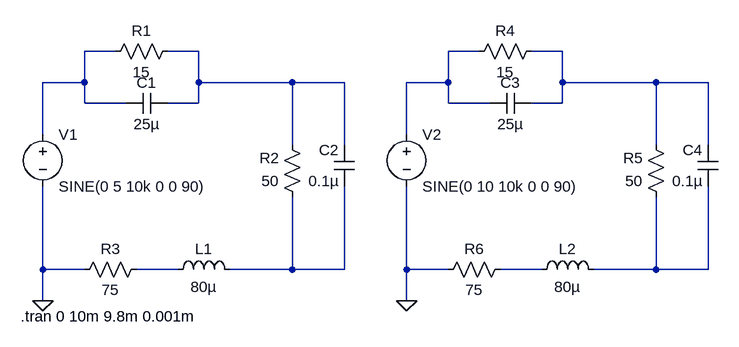
[diagram p0: schematic RTR806_Class_14_20231102_Investigation_of_linearity.asc]
RTR806_Class_14_20231102_Investigation_of_linearity.asc, the LTspice schematic file:
Version 4
SHEET 1 2148 680
WIRE 112 -32 64 -32
WIRE 240 -32 192 -32
WIRE 672 -32 624 -32
WIRE 800 -32 752 -32
WIRE 64 16 64 -32
WIRE 64 16 0 16
WIRE 240 16 240 -32
WIRE 384 16 240 16
WIRE 464 16 384 16
WIRE 624 16 624 -32
WIRE 624 16 560 16
WIRE 800 16 800 -32
WIRE 944 16 800 16
WIRE 1024 16 944 16
WIRE 64 48 64 16
WIRE 128 48 64 48
WIRE 240 48 240 16
WIRE 240 48 192 48
WIRE 624 48 624 16
WIRE 688 48 624 48
WIRE 800 48 800 16
WIRE 800 48 752 48
WIRE 0 96 0 16
WIRE 560 96 560 16
WIRE 384 112 384 16
WIRE 464 112 464 16
WIRE 944 112 944 16
WIRE 1024 112 1024 16
WIRE 0 304 0 176
WIRE 64 304 0 304
WIRE 208 304 144 304
WIRE 384 304 384 192
WIRE 384 304 288 304
WIRE 464 304 464 176
WIRE 464 304 384 304
WIRE 560 304 560 176
WIRE 624 304 560 304
WIRE 768 304 704 304
WIRE 944 304 944 192
WIRE 944 304 848 304
WIRE 1024 304 1024 176
WIRE 1024 304 944 304
WIRE 0 352 0 304
WIRE 560 352 560 304
FLAG 0 352 0
FLAG 560 352 0
SYMBOL voltage 0 80 R0
WINDOW 123 0 0 Left 0
WINDOW 39 0 0 Left 0
SYMATTR InstName V1
SYMATTR Value SINE(0 5 10k 0 0 90)
SYMBOL res 208 -48 R90
WINDOW 0 0 56 VBottom 2
WINDOW 3 32 56 VTop 2
SYMATTR InstName R1
SYMATTR Value 15
SYMBOL res 400 208 R180
WINDOW 0 36 76 Left 2
WINDOW 3 36 40 Left 2
SYMATTR InstName R2
SYMATTR Value 50
SYMBOL res 48 320 R270
WINDOW 0 32 56 VTop 2
WINDOW 3 0 56 VBottom 2
SYMATTR InstName R3
SYMATTR Value 75
SYMBOL ind 192 320 R270
WINDOW 0 32 56 VTop 2
WINDOW 3 5 56 VBottom 2
SYMATTR InstName L1
SYMATTR Value 80µ
SYMBOL cap 192 32 R90
WINDOW 0 0 32 VBottom 2
WINDOW 3 32 32 VTop 2
SYMATTR InstName C1
SYMATTR Value 25µ
SYMBOL cap 480 176 R180
WINDOW 0 24 56 Left 2
WINDOW 3 24 8 Left 2
SYMATTR InstName C2
SYMATTR Value 0.1µ
SYMBOL voltage 560 80 R0
WINDOW 123 0 0 Left 0
WINDOW 39 0 0 Left 0
SYMATTR InstName V2
SYMATTR Value SINE(0 10 10k 0 0 90)
SYMBOL res 768 -48 R90
WINDOW 0 0 56 VBottom 2
WINDOW 3 32 56 VTop 2
SYMATTR InstName R4
SYMATTR Value 15
SYMBOL res 960 208 R180
WINDOW 0 36 76 Left 2
WINDOW 3 36 40 Left 2
SYMATTR InstName R5
SYMATTR Value 50
SYMBOL res 608 320 R270
WINDOW 0 32 56 VTop 2
WINDOW 3 0 56 VBottom 2
SYMATTR InstName R6
SYMATTR Value 75
SYMBOL ind 752 320 R270
WINDOW 0 32 56 VTop 2
WINDOW 3 5 56 VBottom 2
SYMATTR InstName L2
SYMATTR Value 80µ
SYMBOL cap 752 32 R90
WINDOW 0 0 32 VBottom 2
WINDOW 3 32 32 VTop 2
SYMATTR InstName C3
SYMATTR Value 25µ
SYMBOL cap 1040 176 R180
WINDOW 0 24 56 Left 2
WINDOW 3 24 8 Left 2
SYMATTR InstName C4
SYMATTR Value 0.1µ
TEXT -34 376 Left 2 !.tran 0 10m 9.8m 0.001m

The netlist it stands for:
* RTR806_Class_14_20231102_Investigation_of_linearity.asc
V1 N001 0 SINE(0 5 10k 0 0 90)
R1 N002 N001 15
R2 N006 N002 50
R3 0 N005 75
L1 N005 N006 80µ
C1 N002 N001 25µ
C2 N006 N002 0.1µ
V2 N003 0 SINE(0 10 10k 0 0 90)
R4 N004 N003 15
R5 N008 N004 50
R6 0 N007 75
L2 N007 N008 80µ
C3 N004 N003 25µ
C4 N008 N004 0.1µ
.tran 0 10m 9.8m 0.001m
.backanno
.end